# EAGLE schematic Front_Panel_V1A (EAGLE 9.1.2)
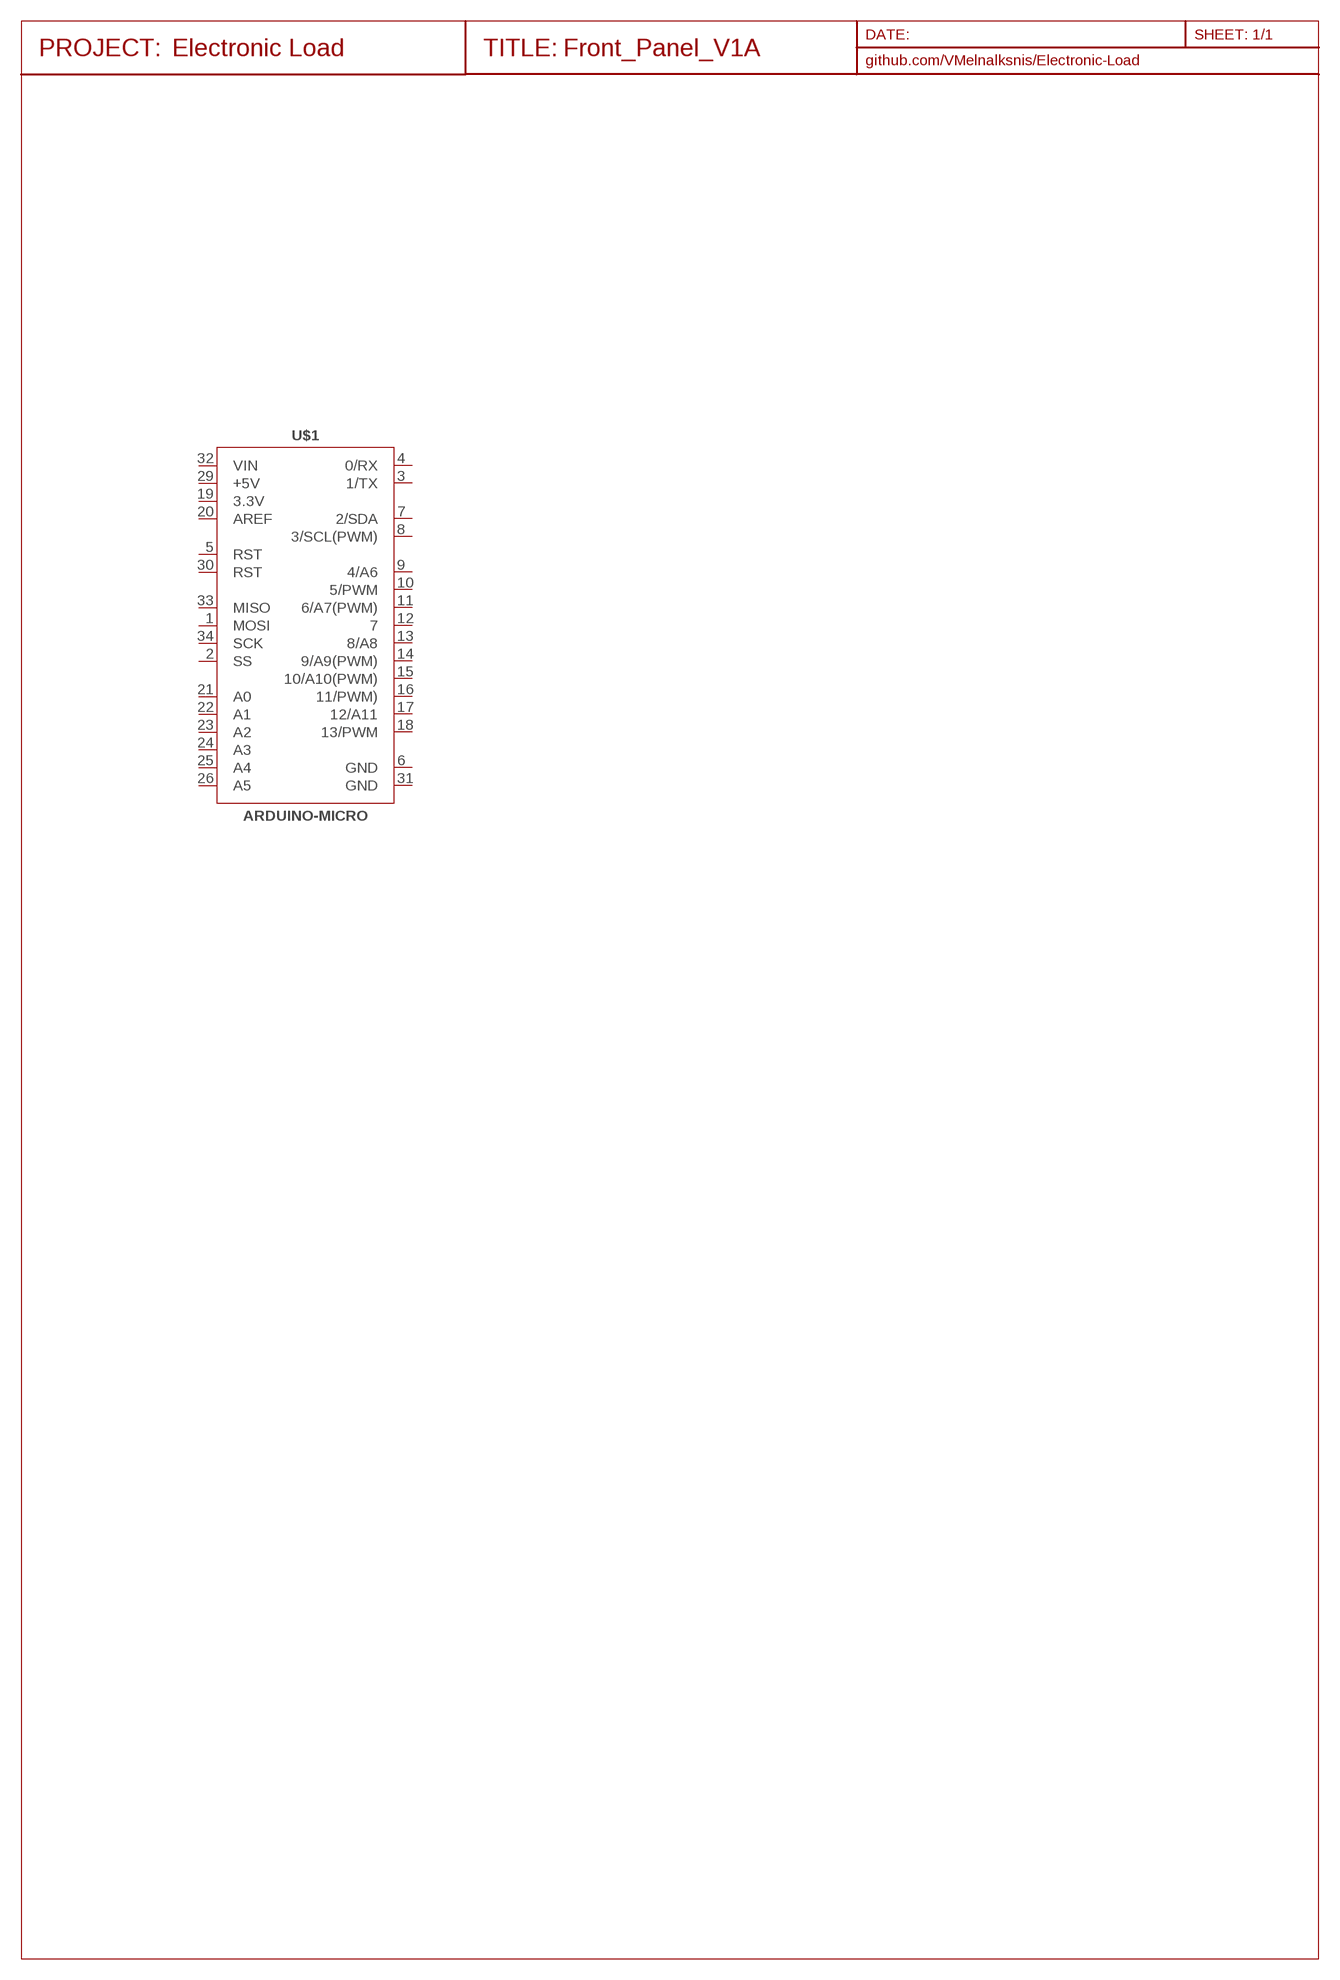
[diagram p0: schematic, sheet 1]
FRAME1 (A4-S35CP): GITHUB: github.com/VMelnalksnis/Electronic-Load; PROJECT_NAME: Electronic Load

## Parts
U$1  ARDUINO-MICRO  [ARDUINO-MICRO]
Unconnected: U$1.1(MOSI) U$1.2(SS) U$1.3(1/TX) U$1.4(0/RX) U$1.5(RST) U$1.7(2/SDA) U$1.8(3/SCL(PWM)) U$1.9(4/A6) U$1.10(5/PWM) U$1.11(6/A7(PWM)) U$1.12 U$1.13(8/A8) U$1.14(9/A9(PWM)) U$1.15(10/A10(PWM)) U$1.16(11/PWM)) U$1.17(12/A11) U$1.18(13/PWM) U$1.20(AREF) U$1.21(A0) U$1.22(A1) U$1.23(A2) U$1.24(A3) U$1.25(A4) U$1.26(A5) U$1.30(RST) U$1.33(MISO) U$1.34(SCK)

## Power pins joined to a net without a drawn wire
3.3V: U$1.19(3.3V)
+5V: U$1.29(+5V)
GND: U$1.6(GND) U$1.31(GND)
VIN: U$1.32(VIN)

## Library data of the parts
U$1 = breakout:ARDUINO-MICRO